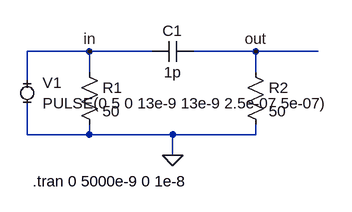
[diagram p0: schematic Draft1.asc]
Draft1.asc, the LTspice schematic file:
Version 4
SHEET 1 880 680
WIRE 80 128 -16 128
WIRE 176 128 80 128
WIRE 336 128 240 128
WIRE 432 128 336 128
WIRE 80 160 80 128
WIRE 336 160 336 128
WIRE -16 176 -16 128
WIRE -16 256 -16 208
WIRE 80 256 80 240
WIRE 80 256 -16 256
WIRE 208 256 80 256
WIRE 336 256 336 240
WIRE 336 256 208 256
WIRE 208 288 208 256
FLAG 208 288 0
FLAG 80 128 in
FLAG 336 128 out
SYMBOL cap 240 112 R90
WINDOW 0 0 32 VBottom 2
WINDOW 3 32 32 VTop 2
SYMATTR InstName C1
SYMATTR Value 1p
SYMBOL res 64 144 R0
SYMATTR InstName R1
SYMATTR Value 50
SYMBOL res 320 144 R0
SYMATTR InstName R2
SYMATTR Value 50
SYMBOL MiniSyms4\\voltage- -16 192 R0
WINDOW 123 0 0 Left 0
WINDOW 39 0 0 Left 0
SYMATTR InstName V1
SYMATTR Value PULSE(0 5 0 13e-9 13e-9 2.5e-07 5e-07)
TEXT -8 328 Left 2 !.tran 0 5000e-9 0 1e-8

The netlist it stands for:
* Draft1.asc
C1 out in 1p
R1 in 0 50
R2 out 0 50
V1 in 0 PULSE(0 5 0 13e-9 13e-9 2.5e-07 5e-07)
.tran 0 5000e-9 0 1e-8
.backanno
.end